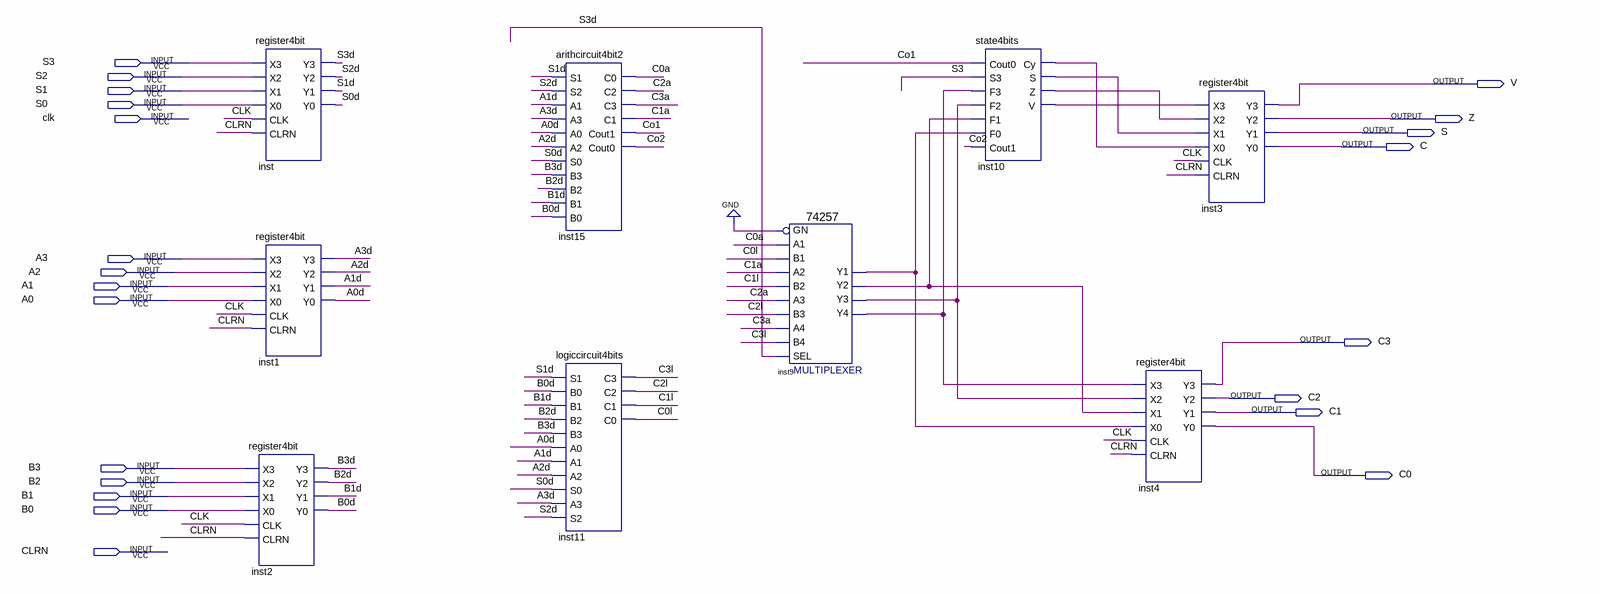
[diagram p0: schematic sheet]
// Quartus schematic Lab3topXXX.bdf as structural Verilog: 9 symbols, 22 pins
module Lab3topXXX (
  input  S3,
  input  S2,
  input  S1,
  input  S0,
  input  clk,
  input  A3,
  input  A2,
  input  A1,
  input  A0,
  input  B3,
  input  B2,
  input  B1,
  input  B0,
  input  CLRN,
  output V,
  output Z,
  output S,
  output C,
  output C3,
  output C2,
  output C1,
  output C0
);

  wire A0d, A1d, A2d, A3d, B0d, B1d, B2d, B3d, C0a, C0l, C1a, C1l, C2a, C2l, C3a, C3l, Co1, Co2, inst9_y1,
       inst9_y2, inst9_y3, inst9_y4, inst10_cy, inst10_s, inst10_v, inst10_z, S0d, S1d, S2d, S3d;

  register4bit inst (
    .X3(S3), .X2(S2), .X1(S1), .X0(S0), .CLK(clk), .CLRN(CLRN), .Y3(S3d), .Y2(S2d), .Y1(S1d), .Y0(S0d));
  register4bit inst1 (
    .X3(A3), .X2(A2), .X1(A1), .X0(A0), .CLK(clk), .CLRN(CLRN), .Y3(A3d), .Y2(A2d), .Y1(A1d), .Y0(A0d));
  register4bit inst2 (
    .X3(B3), .X2(B2), .X1(B1), .X0(B0), .CLK(clk), .CLRN(CLRN), .Y3(B3d), .Y2(B2d), .Y1(B1d), .Y0(B0d));
  arithcircuit4bit2 inst15 (
    .S1(S1d), .S2(S2d), .A1(A1d), .A3(A3d), .A0(A0d), .A2(A2d), .S0(S0d), .B3(B3d), .B2(B2d), .B1(B1d),
    .B0(B0d), .C0(C0a), .C2(C2a), .C3(C3a), .C1(C1a), .Cout1(Co1), .Cout0(Co2));
  logiccircuit4bits inst11 (
    .S1(S1d), .B0(B0d), .B1(B1d), .B2(B2d), .B3(B3d), .A0(A0d), .A1(A1d), .A2(A2d), .S0(S0d), .A3(A3d),
    .S2(S2d), .C3(C3l), .C2(C2l), .C1(C1l), .C0(C0l));
  \74257  inst9 (
    .B1(C0l), .A1(C0a), .B3(C2l), .A2(C1a), .B2(C1l), .A3(C2a), .A4(C3a), .B4(C3l), .SEL(S3d), .GN(1'b0),
    .Y2(inst9_y2), .Y3(inst9_y3), .Y4(inst9_y4), .Y1(inst9_y1));
  state4bits inst10 (
    .Cout0(Co1), .S3(S3), .F3(inst9_y4), .F2(inst9_y3), .F1(inst9_y2), .F0(inst9_y1), .Cout1(Co2),
    .Cy(inst10_cy), .S(inst10_s), .Z(inst10_z), .V(inst10_v));
  register4bit inst4 (
    .X3(inst9_y4), .X2(inst9_y3), .X1(inst9_y2), .X0(inst9_y1), .CLK(clk), .CLRN(CLRN), .Y3(C3), .Y2(C2),
    .Y1(C1), .Y0(C0));
  register4bit inst3 (
    .X3(inst10_v), .X2(inst10_z), .X1(inst10_s), .X0(inst10_cy), .CLK(clk), .CLRN(CLRN), .Y3(V), .Y2(Z),
    .Y1(S), .Y0(C));
endmodule
